# Altium schematic sheet [16] - HDMI.SchDoc
size A3; DocumentNumber: 16; SheetNumber: 16; SheetTotal: 32
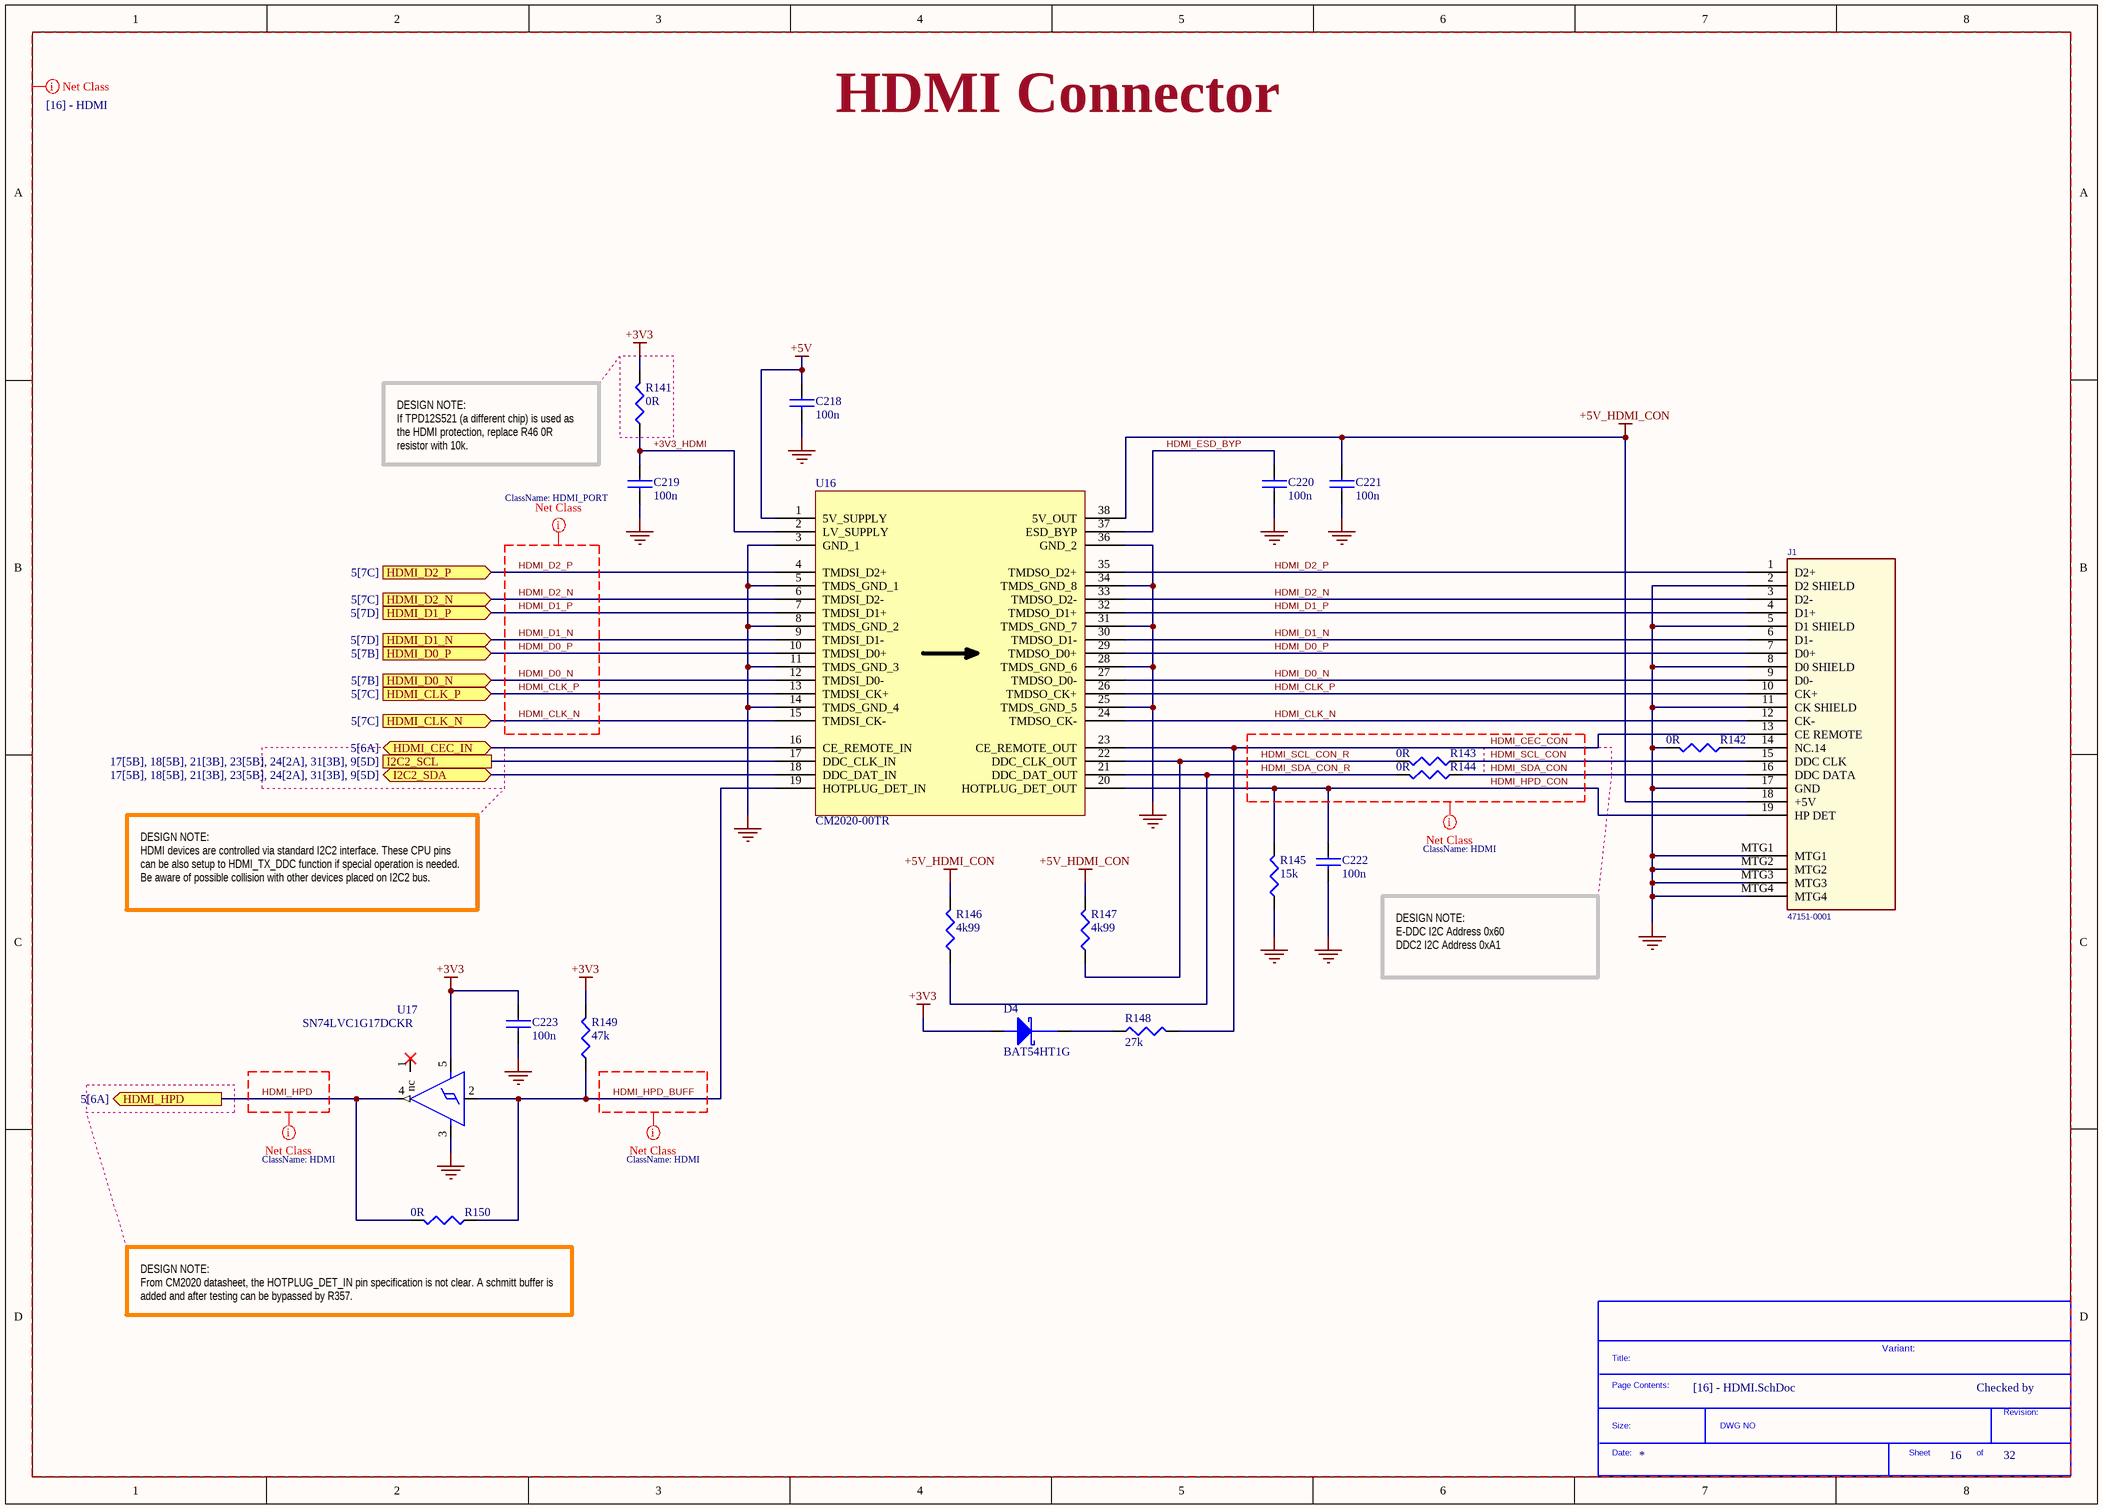
[diagram p0: [16] - HDMI.SchDoc]

## Parts
*  SDTitleBlock  (value not drawn)  (graphical)
C218  100n  [C0402]
C219  100n  [C0402]
C220  100n  [C0402]
C221  100n  [C0402]
C222  100n  [C0402]
C223  100n  [C0402]
D4  BAT54HT1G  [SOD323]
J1  47151-0001  [HDMI V1.1]
R141  0R  [R0402]
R142  0R  [R0402]
R143  0R  [R0402]
R144  0R  [R0402]
R145  15k  [R0402]
R146  4k99  [R0402]
R147  4k99  [R0402]
R148  27k  [R0402]
R149  47k  [R0402]
R150  0R  [R0402]
U16  CM2020-00TR  [TSSOP_38]
U17  SN74LVC1G17DCKR  [SC70_5]

## Ports
HDMI_CEC_IN (bidir, see 5[6A]), HDMI_CLK_N (in, see 5[7C]), HDMI_CLK_P (in, see 5[7C]), HDMI_D0_N (in, see 5[7B]), HDMI_D0_P (in, see 5[7B]), HDMI_D1_N (in, see 5[7D]), HDMI_D1_P (in, see 5[7D]), HDMI_D2_N (in, see 5[7C]), HDMI_D2_P (in, see 5[7C]), HDMI_HPD (out, see 5[6A]), I2C2_SCL (see 17[5B], 18[5B], 21[3B], 23[5B], 24[2A], 31[3B], 9[5D]), I2C2_SDA (bidir, see 17[5B], 18[5B], 21[3B], 23[5B], 24[2A], 31[3B], 9[5D])

## Nets
+3V3: C223.1 D4.2(Anode) R141.2 R149.2 U17.5(NC1)
+5V: C218.1 U16.1(5V_SUPPLY)
+5V_HDMI_CON: C221.1 J1.18(+5V) R146.2 R147.2 U16.38(5V_OUT)
GND: C218.2 C219.2 C220.2 C221.2 C222.2 C223.2 J1.2(D2_SHIELD) J1.5(D1_SHIELD) J1.8(D0_SHIELD) J1.11(CK_SHIELD) J1.17(GND) J1.MTG1 J1.MTG2 J1.MTG3 J1.MTG4 R142.2 R145.1 U16.3(GND_1) U16.5(TMDS_GND_1) U16.8(TMDS_GND_2) U16.11(TMDS_GND_3) U16.14(TMDS_GND_4) U16.25(TMDS_GND_5) U16.28(TMDS_GND_6) U16.31(TMDS_GND_7) U16.34(TMDS_GND_8) U16.36(GND_2) U17.3(GND)
+3V3_HDMI: C219.1 R141.1 U16.2(LV_SUPPLY)
HDMI_CEC_CON: J1.13(CE_REMOTE) R148.2 U16.23(CE_REMOTE_OUT)
HDMI_CEC_IN: U16.16(CE_REMOTE_IN) ; port HDMI_CEC_IN
HDMI_CLK_N: J1.12(CK-) U16.15(TMDSI_CK-) U16.24(TMDSO_CK-) ; port HDMI_CLK_N
HDMI_CLK_P: J1.10(CK+) U16.13(TMDSI_CK+) U16.26(TMDSO_CK+) ; port HDMI_CLK_P
HDMI_D0_N: J1.9(D0-) U16.12(TMDSI_D0-) U16.27(TMDSO_D0-) ; port HDMI_D0_N
HDMI_D0_P: J1.7(D0+) U16.10(TMDSI_D0+) U16.29(TMDSO_D0+) ; port HDMI_D0_P
HDMI_D1_N: J1.6(D1-) U16.9(TMDSI_D1-) U16.30(TMDSO_D1-) ; port HDMI_D1_N
HDMI_D1_P: J1.4(D1+) U16.7(TMDSI_D1+) U16.32(TMDSO_D1+) ; port HDMI_D1_P
HDMI_D2_N: J1.3(D2-) U16.6(TMDSI_D2-) U16.33(TMDSO_D2-) ; port HDMI_D2_N
HDMI_D2_P: J1.1(D2+) U16.4(TMDSI_D2+) U16.35(TMDSO_D2+) ; port HDMI_D2_P
HDMI_ESD_BYP: C220.1 U16.37(ESD_BYP)
HDMI_HPD: R150.2 U17.4(O) ; port HDMI_HPD
HDMI_HPD_BUFF: R149.1 R150.1 U16.19(HOTPLUG_DET_IN) U17.2(I)
HDMI_HPD_CON: C222.1 J1.19(HP_DET) R145.2 U16.20(HOTPLUG_DET_OUT)
HDMI_SCL_CON: J1.15(DDC_CLK) R143.1
HDMI_SCL_CON_R: R143.2 R147.1 U16.22(DDC_CLK_OUT)
HDMI_SDA_CON: J1.16(DDC_DATA) R144.1
HDMI_SDA_CON_R: R144.2 R146.1 U16.21(DDC_DAT_OUT)
I2C2_SCL: U16.17(DDC_CLK_IN) ; port I2C2_SCL
I2C2_SDA: U16.18(DDC_DAT_IN) ; port I2C2_SDA
NetD4_1: D4.1(Cathode) R148.1
NetJ1_14: J1.14(NC.14) R142.1

Not connected (* = marked no-connect by the designer): U17 1(nc)*

## Layout directives
net class HDMI: HDMI_CEC_CON, HDMI_HPD, HDMI_HPD_BUFF, HDMI_HPD_CON, HDMI_SCL_CON, HDMI_SCL_CON_R, HDMI_SDA_CON, HDMI_SDA_CON_R
net class [16] - HDMI: +3V3, +3V3_HDMI, +5V, +5V_HDMI_CON, GND, HDMI_CEC_CON, HDMI_CLK_N, HDMI_CLK_P, HDMI_D0_N, HDMI_D0_P, HDMI_D1_N, HDMI_D1_P, HDMI_D2_N, HDMI_D2_P, HDMI_ESD_BYP, HDMI_HPD, HDMI_HPD_BUFF, HDMI_HPD_CON, HDMI_SCL_CON, HDMI_SCL_CON_R, HDMI_SDA_CON, HDMI_SDA_CON_R
net class HDMI_PORT: HDMI_CLK_N, HDMI_CLK_P, HDMI_D0_N, HDMI_D0_P, HDMI_D1_N, HDMI_D1_P, HDMI_D2_N, HDMI_D2_P

## Notes on the sheet
- HDMI Connector
- DESIGN NOTE:
  If TPD12S521 (a different chip) is used as the HDMI protection, replace R46 0R resistor with 10k.
- DESIGN NOTE:
  HDMI devices are controlled via standard I2C2 interface. These CPU pins can be also setup to HDMI_TX_DDC function if special operation is needed. Be aware of possible collision with other devices placed on I2C2 bus.
- DESIGN NOTE:
  E-DDC I2C Address 0x60
  DDC2 I2C Address 0xA1
- (near R150) DESIGN NOTE:
  From CM2020 datasheet, the HOTPLUG_DET_IN pin specification is not clear. A schmitt buffer is added and after testing can be bypassed by R357.
- Variant:
- Checked by
- (in symbol SDTitleBlock) Title:; Page Contents:; Revision:; Size:; DWG NO; Date:; Sheet; of

## Library data of the parts
C218-C223 = C1005X5R1H104K: CAP CER .10UF 50V X5R 10% 0402; Manufacturer: TDK Corporation; Capacitance: 0.1µF; Value: 100nF; .Checked PCB: used; Category: Capacitors; Supplier Part Number: 445-5942-1-ND; Manufacturer Part Number: C1005X5R1H104K; Operating Temperature: -55°C ~ 85°C; Package / Case: 0402 (1005 Metric); Price 1k [$]: 0.02340; .Checked SCH: used; Voltage - Rated: 50V; Supplier: Digikey; Supplier 1: Digi-Key; Supplier Part Number 1: 445-5942-1-ND; RoHS: RoHS Compliant; Stock 1: 106926; Pricing 1: 1=0.27, 10=0.18, 100=0.072, 250=0.05176, 500=0.0369, 1000=0.027 (USD); Tolerance: ±10%; Temperature Coefficient: X5R; Mounting Type: Surface Mount, MLCC; Applications: General Purpose; Ratings: -; Size / Dimension: 0.039" L x 0.020" W (1.00mm x 0.50mm); Height - Seated (Max): -; Thickness (Max): 0.022" (0.55mm); Lead Spacing: -; Features: -; Packaging: Cut Tape (CT); Lead Style: -; ComponentLink1URL: http://www.tdk.co.jp/tefe02/e412_c.pdf; ComponentLink1Description: http://www.tdk.co.jp/tefe02/e412_c.pdf; Supplier 2: Digi-Key; Supplier Part Number 2: 311-1697-6-ND
D4 = BAT54HT1G: DIODE SCHOTTKY 30V 0.2A SOD323; Manufacturer: Fairchild Semiconductor; Current - Average Rectified (Io): 200mA; Voltage - Forward (Vf) (Max) @ If: 800mV @ 100mA; Speed: Small Signal =< 200mA (Io), Any Speed; Reverse Recovery Time (trr): 5ns; Current - Reverse Leakage @ Vr: 2µA @ 25V; Capacitance @ Vr, F: 10pF @ 1V, 1MHz; Thermal Resistance: 600°C/W Ja; .Creator: MM; .Checked PCB: used; Supplier 1: Digi-Key; Manufacturer Part Number: BAT54HT1G; RoHS: RoHS Compliant; Category: Discrete Semiconductor Products; Stock 1: 11388; Pricing 1: 1=0.3, 10=0.276, 25=0.1984, 100=0.1543, 250=0.09696, 500=0.0826, 1000=0.05628 (USD); Packaging: Cut Tape (CT); Diode Type: Schottky; Voltage - DC Reverse (Vr) (Max): 30V; Mounting Type: Surface Mount; Package / Case: SC-76, SOD-323; Supplier Device Package: SOD-323; Operating Temperature - Junction: -55°C ~ 150°C; ComponentLink1URL: http://www.fairchildsemi.com/ds/BA/BAT54HT1G.pdf; ComponentLink1Description: http://www.fairchildsemi.com/ds/BA/BAT54HT1G.pdf; Supplier Part Number 1: BAT54HT1GCT-ND; .Checked SCH: used; Supplier 2: Digi-Key; Supplier Part Number 2: NSVBAT54HT1GOSCT-ND
J1 = 47151-0001_v1.1: CONN RCPT 19POS HDMI RT ANG SMD; Manufacturer: Molex Connector Corporation; .Checked PCB: used; Number of Positions: 19; Pitch: 0.50mm (.020"); Gender: Receptacle; .Version: V1.1 - Changed holes to slots; .Checked SCH: used; Category: Connectors, Interconnects; Connector Type: HDMI; Family: USB, IEEE-1394 (Firewire), DVI, HDMI; Manufacturer Part Number: 47151-0001; Operating Temperature: -20°C to +85°C; Price 1k [$]: 1.74610; Supplier: Digikey; Supplier Part Number: WM19086CT-ND; Value: 47151-0001; Supplier 1: Digi-Key; Supplier Part Number 1: WM19086CT-ND; RoHS: RoHS Compliant; Stock 1: 2756; Pricing 1: 1=3.1, 10=2.57, 50=2.1456, 100=1.9034 (USD); Number of Contacts: 19; Specifications: -; Mounting Type: Surface Mount, Right Angle, Horizontal; Features: Detent Lock; Packaging: Cut Tape (CT); Ingress Protection: -; ComponentLink1URL: http://www.molex.com/pdm_docs/sd/471510001_sd.pdf; ComponentLink1Description: http://www.molex.com/pdm_docs/sd/471510001_sd.pdf
R141-R144 R150 = RC0402JR-070RL: RES 0.0 OHM 1/16W 0402 SMD; Manufacturer: Yageo; Resistance (Ohms): 0.0; Power (Watts): 0.063W, 1/16W; Tolerance: Jumper; .Checked PCB: used; Category: Resistors; Manufacturer Part Number: RC0402JR-070RL; Package / Case: 0402 (1005 Metric); Price 1k [$]: 0.01389; Value: 0R; .Checked SCH: used; Supplier Part Number: 311-0.0JRCT-ND; Supplier: Digikey; Supplier 1: Digi-Key; Supplier Part Number 1: 311-0.0JRCT-ND; RoHS: RoHS Compliant; Stock 1: 1106330; Pricing 1: 10=0.012, 50=0.009, 100=0.0069, 250=0.00512, 500=0.0038, 1000=0.00253 (USD); Composition: Thick Film; Features: -; Temperature Coefficient: -; Size / Dimension: 0.039" L x 0.020" W (1.00mm x 0.50mm); Height: 0.016" (0.40mm); Number of Terminations: 2; Packaging: Cut Tape (CT); ComponentLink1URL: http://www.yageo.com/documents/recent/PYu-RC0402_51_RoHS_L_6.pdf; ComponentLink1Description: http://www.yageo.com/documents/recent/PYu-RC0402_51_RoHS_L_6.pdf
R145 = RC0402FR-0715KL: RES 15.0K OHM 1/16W 1% 0402 SMD; Manufacturer: Yageo; Power (Watts): 0.063W, 1/16W; .Checked PCB: used; Temperature Coefficient: ±100ppm/°C; Category: Resistors; Supplier Part Number: 311-15.0KLRCT-ND; Manufacturer Part Number: RC0402FR-0715KL; Package / Case: 0402 (1005 Metric); Price 1k [$]: 0.01421; Resistance (Ohms): 15K; Tolerance: ±1%; Value: 15k; .Checked SCH: used; Supplier: Digikey; Supplier 1: Digi-Key; Supplier Part Number 1: 311-15.0KLRCT-ND; RoHS: RoHS Compliant; Stock 1: 31992; Pricing 1: 10=0.014, 50=0.0104, 100=0.0079, 250=0.00584, 500=0.00432, 1000=0.00288 (USD); Composition: Thick Film; Features: -; Size / Dimension: 0.039" L x 0.020" W (1.00mm x 0.50mm); Height: 0.016" (0.40mm); Number of Terminations: 2; Packaging: Cut Tape (CT); ComponentLink1URL: http://www.yageo.com/documents/recent/PYu-RC0402_51_RoHS_L_6.pdf; ComponentLink1Description: http://www.yageo.com/documents/recent/PYu-RC0402_51_RoHS_L_6.pdf
R146 R147 = RMCF0402FT4K99: RES TF 4.99K OHM 1% 1/16W 0402; Manufacturer: Stackpole Electronics Inc; Power (Watts): 0.063W, 1/16W; .Checked PCB: used; Temperature Coefficient: ±100ppm/°C; Category: Resistors; Supplier Part Number: RMCF0402FT4K99CT-ND; Manufacturer Part Number: RMCF0402FT4K99; Package / Case: 0402 (1005 Metric); Price 1k [$]: 0.00384; Resistance (Ohms): 4.99K; Tolerance: ±1%; Value: 4k99; .Checked SCH: used; Supplier: Digikey; Supplier 1: Digi-Key; Supplier Part Number 1: RMCF0402FT4K99CT-ND; RoHS: RoHS Compliant; Stock 1: 48509; Pricing 1: 1=0.04, 10=0.025, 50=0.0138, 100=0.0105, 250=0.0078, 500=0.00576, 1000=0.00384 (USD); Composition: Thick Film; Features: -; Size / Dimension: 0.039" L x 0.020" W (1.00mm x 0.50mm); Height: 0.016" (0.40mm); Number of Terminations: 2; Packaging: Cut Tape (CT); ComponentLink1URL: http://www.seielect.com/Catalog/SEI-RMCF.pdf; ComponentLink1Description: http://www.seielect.com/Catalog/SEI-RMCF.pdf
R148 = RC0402FR-0727KL: RES 27.0K OHM 1/16W 1% 0402 SMD; Manufacturer: Yageo; Power (Watts): 0.063W, 1/16W; .Checked PCB: used; Temperature Coefficient: ±100ppm/°C; Category: Resistors; Supplier Part Number: 311-27.0KLRCT-ND; Manufacturer Part Number: RC0402FR-0727KL; Package / Case: 0402 (1005 Metric); Price 1k [$]: 0.00288; Resistance (Ohms): 27K; Tolerance: ±1%; Value: 27k; .Checked SCH: used; Supplier: Digikey; Supplier 1: Digi-Key; Supplier Part Number 1: 311-27.0KLRCT-ND; RoHS: RoHS Compliant; Stock 1: 21638; Pricing 1: 10=0.014, 50=0.0104, 100=0.0079, 250=0.00584, 500=0.00432, 1000=0.00288 (USD); Composition: Thick Film; Features: -; Size / Dimension: 0.039" L x 0.020" W (1.00mm x 0.50mm); Height: 0.016" (0.40mm); Number of Terminations: 2; Packaging: Cut Tape (CT); ComponentLink1URL: http://www.yageo.com/documents/recent/PYu-RC0402_51_RoHS_L_6.pdf; ComponentLink1Description: http://www.yageo.com/documents/recent/PYu-RC0402_51_RoHS_L_6.pdf
R149 = RC0402FR-0747KL: RES 47.0K OHM 1/16W 1% 0402 SMD; Manufacturer: Yageo; Power (Watts): 0.063W, 1/16W; .Checked PCB: used; Temperature Coefficient: ±100ppm/°C; Category: Resistors; Supplier Part Number: 311-47.0KLRCT-ND; Manufacturer Part Number: RC0402FR-0747KL; Package / Case: 0402 (1005 Metric); Price 1k [$]: 0.01421; Resistance (Ohms): 47K; Tolerance: ±1%; Value: 47k; .Checked SCH: used; Supplier: Digikey; Supplier 1: Digi-Key; Supplier Part Number 1: 311-47.0KLRCT-ND; RoHS: RoHS Compliant; Stock 1: 1227580; Pricing 1: 10=0.014, 50=0.0104, 100=0.0079, 250=0.00584, 500=0.00432, 1000=0.00288 (USD); Composition: Thick Film; Features: -; Size / Dimension: 0.039" L x 0.020" W (1.00mm x 0.50mm); Height: 0.016" (0.40mm); Number of Terminations: 2; Packaging: Cut Tape (CT); ComponentLink1URL: http://www.yageo.com/documents/recent/PYu-RC0402_51_RoHS_L_6.pdf; ComponentLink1Description: http://www.yageo.com/documents/recent/PYu-RC0402_51_RoHS_L_6.pdf; Supplier 2: Digi-Key; Supplier Part Number 2: 1276-3467-1-ND
U16 = CM2020-00TR: IC HDMI TX PORT P/I 38-TSSOP; Manufacturer: ON Semiconductor; .Creator: MM; .Checked PCB: used; Supplier 1: Digi-Key; Manufacturer Part Number: CM2020-00TR; RoHS: RoHS Compliant; Category: Integrated Circuits (ICs); Stock 1: 7580; Pricing 1: 1=1.52, 10=1.34, 25=1.2096, 100=1.0584, 250=0.9282, 500=0.8232, 1000=0.651 (USD); Packaging: Cut Tape (CT); Type: HDMI Transmitter; Applications: Consumer Electronics, DVD-RW Players, Set Top Box; Mounting Type: Surface Mount; Package / Case: 38-TFSOP (0.173", 4.40mm Width) Exposed Pad; Supplier Device Package: 38-TSSOP; ComponentLink1URL: http://www.onsemi.com/pub_link/Collateral/CM2020-00TR-D.PDF; ComponentLink1Description: http://www.onsemi.com/pub_link/Collateral/CM2020-00TR-D.PDF; Supplier Part Number 1: CM2020-00TROSCT-ND; .Checked SCH: used
U17 = SN74LVC1G17DCKR: IC BUFFER SCHMIT TRIG SC705; Manufacturer: Texas Instruments; Logic Type: Schmitt Trigger - Buffer, Driver; Number of Elements: 1; Current - Output High, Low: 32mA, 32mA; Voltage - Supply: 1.65 V ~ 5.5 V; .Checked PCB: used; Supplier 1: Digi-Key; Supplier Part Number 1: 296-11934-1-ND; Manufacturer Part Number: SN74LVC1G17DCKR; RoHS: RoHS Compliant; Category: Integrated Circuits (ICs); Stock 1: 50549; Pricing 1: 1=0.12, 10=0.097, 25=0.086, 100=0.0581, 250=0.05696, 500=0.0559, 750=0.05483 (USD); Number of Bits per Element: 1; Operating Temperature: -40°C ~ 85°C; Mounting Type: Surface Mount; Package / Case: 6-TSSOP (5 Lead), SC-88A, SOT-353; Supplier Device Package: SC-70-5; Packaging: Cut Tape (CT); ComponentLink1URL: http://www.ti.com/lit/ds/symlink/sn74lvc1g17.pdf; ComponentLink1Description: http://www.ti.com/lit/ds/symlink/sn74lvc1g17.pdf; .Checked SCH: used